# Altium schematic sheet BQ105-A4.SchDoc
size A2
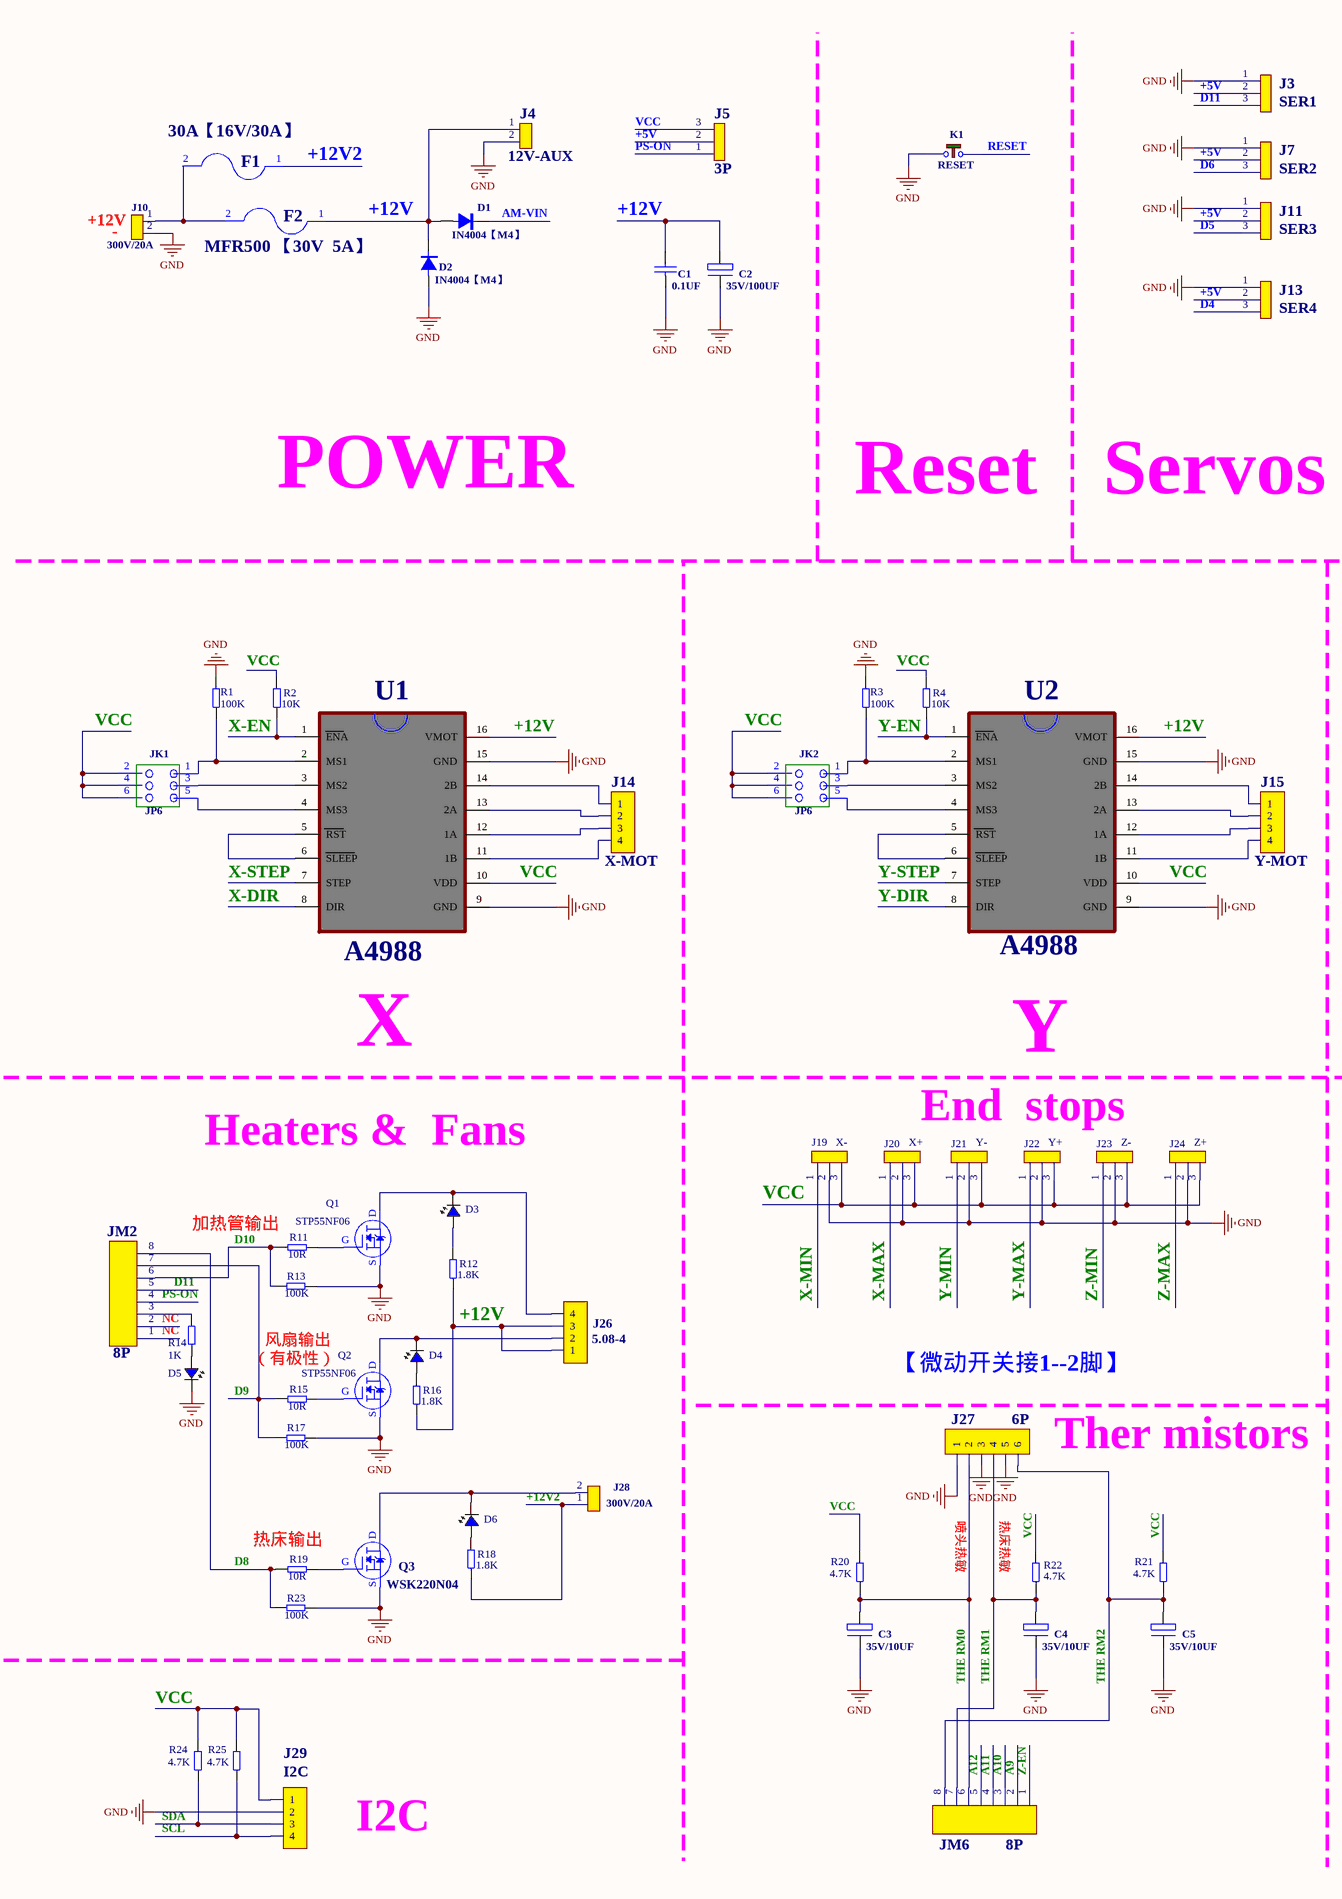
[diagram p0: BQ105-A4.SchDoc, left]
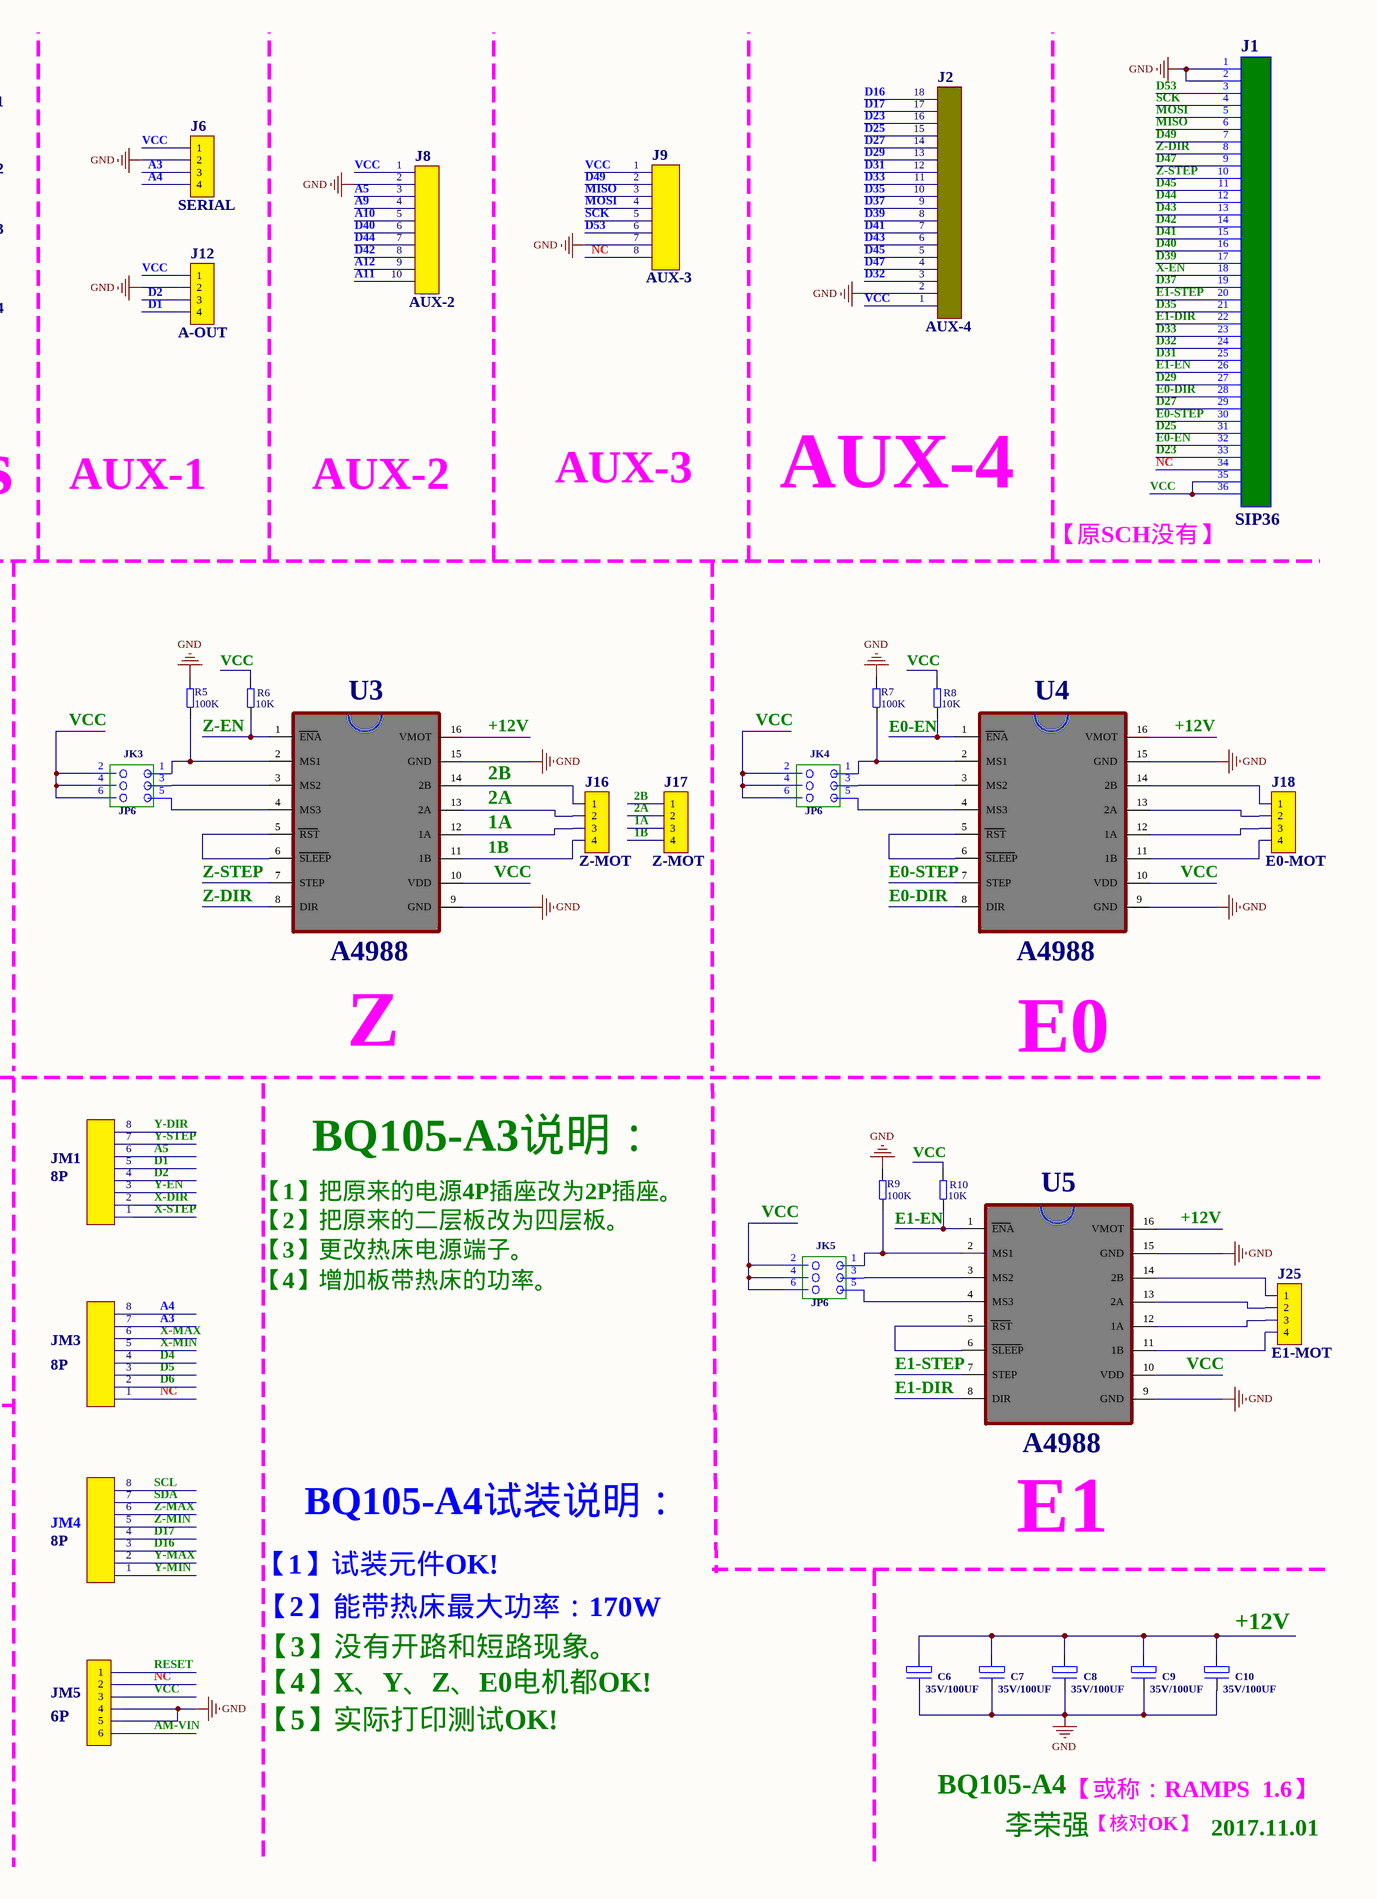
[diagram p1: BQ105-A4.SchDoc, right]

## Parts
C1  0.1UF  [0603N]
C2  35V/100UF  [35V/100UF-2]
C3  35V/10UF  [35V/10UF]
C4  35V/10UF  [35V/10UF]
C5  35V/10UF  [35V/10UF]
C6  35V/100UF  [35V/100UF-2]
C7  35V/100UF  [35V/100UF-2]
C8  35V/100UF  [35V/100UF-2]
C9  35V/100UF  [35V/100UF-2]
C10  35V/100UF  [35V/100UF-2]
D1  IN4004【M4】  [DO-214AC]
D2  IN4004【M4】  [DO-214AC]
D3  LED  [LED-0603]  (value not drawn)
D4  LED  [LED-0603]  (value not drawn)
D5  LED  [LED-0603]  (value not drawn)
D6  LED  [LED-0603]  (value not drawn)
F1  30A【16V/30A】  [1206]
F2  MFR500 【30V  5A】  [1206]
J1  SIP36  [2.54-36]
J2  AUX-4  [SIP18]
J3  SER1  [SIP3]
J4  12V-AUX  [SIP2]
J5  3P  [SIP3]
J6  SERIAL  [2.54-4]
J7  SER2  [SIP3]
J8  AUX-2  [2.54-10]
J9  AUX-3  [2.54-8]
J10  300V/20A  [5.08-2]
J11  SER3  [SIP3]
J12  A-OUT  [2.54-4]
J13  SER4  [SIP3]
J14  X-MOT  [SIP4]
J15  Y-MOT  [SIP4]
J16  Z-MOT  [SIP4]
J17  Z-MOT  [SIP4]
J18  E0-MOT  [SIP4]
J19  X-  [SIP3]
J20  X+  [SIP3]
J21  Y-  [SIP3]
J22  Y+  [SIP3]
J23  Z-  [SIP3]
J24  Z+  [SIP3]
J25  E1-MOT  [SIP4]
J26  5.08-4  [5.08-4-B]
J27  6P  [2.54-6]
J28  300V/20A  [5.08-2]
J29  I2C  [SIP4]
JK1  JP6  [ICSP-6]
JK2  JP6  [ICSP-6]
JK3  JP6  [ICSP-6]
JK4  JP6  [ICSP-6]
JK5  JP6  [ICSP-6]
JM1  8P  [SIP8]
JM2  8P  [SIP8]
JM3  8P  [SIP8]
JM4  8P  [SIP8]
JM5  6P  [SIP6]
JM6  8P  [SIP8]
K1  RESET  [K7]
Q1  STP55NF06  [TO-263-M]
Q2  STP55NF06  [TO-263-M]
Q3  WSK220N04  [TO-263-M]
R1  100K  [0603N]
R2  10K  [0603N]
R3  100K  [0603N]
R4  10K  [0603N]
R5  100K  [0603N]
R6  10K  [0603N]
R7  100K  [0603N]
R8  10K  [0603N]
R9  100K  [0603N]
R10  10K  [0603N]
R11  10R  [0603N]
R12  1.8K  [0603N]
R13  100K  [0603N]
R14  1K  [0603N]
R15  10R  [0603N]
R16  1.8K  [0603N]
R17  100K  [0603N]
R18  1.8K  [0603N]
R19  10R  [0603N]
R20  4.7K  [0603N]
R21  4.7K  [0603N]
R22  4.7K  [0603N]
R23  100K  [0603N]
R24  4.7K  [0603N]
R25  4.7K  [0603N]
U1  A4988  [A4988-2]
U2  A4988  [A4988-2]
U3  A4988  [A4988-2]
U4  A4988  [A4988-2]
U5  A4988  [A4988-2]

## Nets
GND: C1.1 C2.2(-) C3.2(-) C4.2(-) C5.2(-) C6.2(-) C7.2(-) C8.2(-) C9.2(-) C10.2(-) D2.1(A) D5.2(K) J1.1 J1.2 J2.2 J3.1 J4.2 J6.2 J7.1 J8.2 J9.7 J10.2 J11.1 J12.2 J13.1 J19.2 J20.2 J21.2 J22.2 J23.2 J24.2 J27.1 J27.3 J27.5 J29.2 JM5.4 JM5.5 K1.1 Q1.S Q2.S Q3.S R1.2 R3.2 R5.2 R7.2 R9.2 R13.2 R17.2 R23.2 U1.9(GND) U1.15(GND) U2.9(GND) U2.15(GND) U3.9(GND) U3.15(GND) U4.9(GND) U4.15(GND) U5.9(GND) U5.15(GND)
1A: J16.3 J17.3 U3.12(1A)
1B: J16.4 J17.4 U3.11(1B)
2A: J16.2 J17.2 U3.13(2A)
2B: J16.1 J17.1 U3.14(2B)
+5V: J3.2 J5.2 J7.2 J11.2 J13.2
+12V: C1.2 C2.1(+) C6.1(+) C7.1(+) C8.1(+) C9.1(+) C10.1(+) D1.1(A) D2.2(K) F2.1 J4.1 J26.1 J26.3 R12.1 R16.1 U1.16(VMOT) U2.16(VMOT) U3.16(VMOT) U4.16(VMOT) U5.16(VMOT)
+12V2: F1.1 J28.1 R18.1
A3: J6.3 JM3.7
A4: J6.4 JM3.8
A5: J8.3 JM1.6
A9: J8.4 JM6.2
A10: J8.5 JM6.3
A11: J8.10 JM6.4
A12: J8.9 JM6.5
AM-VIN: D1.2(K) JM5.6
D1: J12.4 JM1.5
D2: J12.3 JM1.4
D4: J13.3 JM3.4
D5: J11.3 JM3.3
D6: J7.3 JM3.2
D8: JM2.8 R19.1 R23.1
D9: JM2.7 R15.1 R17.1
D10: JM2.6 R11.1 R13.1
D11: J3.3 JM2.5
D16: J2.18 JM4.3
D17: J2.17 JM4.4
D23: J1.33 J2.16
D25: J1.31 J2.15
D27: J1.29 J2.14
D29: J1.27 J2.13
D31: J1.25 J2.12
D32: J1.24 J2.3
D33: J1.23 J2.11
D35: J1.21 J2.10
D37: J1.19 J2.9
D39: J1.17 J2.8
D40: J1.16 J8.6
D41: J1.15 J2.7
D42: J1.14 J8.8
D43: J1.13 J2.6
D44: J1.12 J8.7
D45: J1.11 J2.5
D47: J1.9 J2.4
D49: J1.7 J9.2
D53: J1.3 J9.6
E0-DIR: J1.28 U4.8(DIR)
E0-EN: J1.32 R8.1 U4.1(ENA)
E0-STEP: J1.30 U4.7(STEP)
E1-DIR: J1.22 U5.8(DIR)
E1-EN: J1.26 R10.1 U5.1(ENA)
E1-STEP: J1.20 U5.7(STEP)
MISO: J1.6 J9.3
MOSI: J1.5 J9.4
PS-ON: J5.1 JM2.4
RESET: JM5.1 K1.2
SCK: J1.4 J9.5
SCL: J29.4 JM4.8 R25.1
SDA: J29.3 JM4.7 R24.1
THE RM0: C3.1(+) J27.2 JM6.6 R20.1
THE RM1: C4.1(+) J27.4 JM6.7 R22.1
THE RM2: C5.1(+) J27.6 JM6.8 R21.1
VCC: J1.35 J1.36 J2.1 J5.3 J6.1 J8.1 J9.1 J12.1 J19.3 J20.3 J21.3 J22.3 J23.3 J24.3 J29.1 JK1.2 JK1.4 JK1.6 JK2.2 JK2.4 JK2.6 JK3.2 JK3.4 JK3.6 JK4.2 JK4.4 JK4.6 JK5.2 JK5.4 JK5.6 JM5.3 R2.2 R4.2 R6.2 R8.2 R10.2 R20.2 R21.2 R22.2 R24.2 R25.2 U1.10(VDD) U2.10(VDD) U3.10(VDD) U4.10(VDD) U5.10(VDD)
X-DIR: JM1.2 U1.8(DIR)
X-EN: J1.18 R2.1 U1.1(ENA)
X-MAX: J20.1 JM3.6
X-MIN: J19.1 JM3.5
X-STEP: JM1.1 U1.7(STEP)
Y-DIR: JM1.8 U2.8(DIR)
Y-EN: JM1.3 R4.1 U2.1(ENA)
Y-MAX: J22.1 JM4.2
Y-MIN: J21.1 JM4.1
Y-STEP: JM1.7 U2.7(STEP)
Z-DIR: J1.8 U3.8(DIR)
Z-EN: JM6.1 R6.1 U3.1(ENA)
Z-MAX: J24.1 JM4.6
Z-MIN: J23.1 JM4.5
Z-STEP: J1.10 U3.7(STEP)
NetD3_1: D3.1(A) R12.2
NetD3_2: D3.2(K) J26.4 Q1.D
NetD4_1: D4.1(A) R16.2
NetD4_2: D4.2(K) J26.2 Q2.D
NetD5_1: D5.1(A) R14.2
NetD6_1: D6.1(A) R18.2
NetD6_2: D6.2(K) J28.2 Q3.D
NetF1_2: F1.2 F2.2 J10.1
NetJ14_1: J14.1 U1.14(2B)
NetJ14_2: J14.2 U1.13(2A)
NetJ14_3: J14.3 U1.12(1A)
NetJ14_4: J14.4 U1.11(1B)
NetJ15_1: J15.1 U2.14(2B)
NetJ15_2: J15.2 U2.13(2A)
NetJ15_3: J15.3 U2.12(1A)
NetJ15_4: J15.4 U2.11(1B)
NetJ18_1: J18.1 U4.14(2B)
NetJ18_2: J18.2 U4.13(2A)
NetJ18_3: J18.3 U4.12(1A)
NetJ18_4: J18.4 U4.11(1B)
NetJ25_1: J25.1 U5.14(2B)
NetJ25_2: J25.2 U5.13(2A)
NetJ25_3: J25.3 U5.12(1A)
NetJ25_4: J25.4 U5.11(1B)
NetJK1_1: JK1.1 R1.1 U1.2(MS1)
NetJK1_3: JK1.3 U1.3(MS2)
NetJK1_5: JK1.5 U1.4(MS3)
NetJK2_1: JK2.1 R3.1 U2.2(MS1)
NetJK2_3: JK2.3 U2.3(MS2)
NetJK2_5: JK2.5 U2.4(MS3)
NetJK3_1: JK3.1 R5.1 U3.2(MS1)
NetJK3_3: JK3.3 U3.3(MS2)
NetJK3_5: JK3.5 U3.4(MS3)
NetJK4_1: JK4.1 R7.1 U4.2(MS1)
NetJK4_3: JK4.3 U4.3(MS2)
NetJK4_5: JK4.5 U4.4(MS3)
NetJK5_1: JK5.1 R9.1 U5.2(MS1)
NetJK5_3: JK5.3 U5.3(MS2)
NetJK5_5: JK5.5 U5.4(MS3)
NetJM2_3: JM2.3 R14.1
NetQ1_G: Q1.G R11.2
NetQ2_G: Q2.G R15.2
NetQ3_G: Q3.G R19.2
NetU1_5: U1.5(RST) U1.6(SLEEP)
NetU2_5: U2.5(RST) U2.6(SLEEP)
NetU3_5: U3.5(RST) U3.6(SLEEP)
NetU4_5: U4.5(RST) U4.6(SLEEP)
NetU5_5: U5.5(RST) U5.6(SLEEP)

Not connected (* = marked no-connect by the designer): J1 34; J9 8; JM2 1 2; JM3 1; JM5 2

## Notes on the sheet
- (near J10) +12V
- (near J10) -
- NC
- POWER
- Reset
- Servos
- AUX-1
- AUX-2
- AUX-3
- AUX-4
- 【原SCH没有】
- X
- Y
- Z
- E0
- End  stops
- Heaters &  Fans
- BQ105-A3说明：
- 加热管输出
- 【1】把原来的电源4P插座改为2P插座。
- 【2】把原来的二层板改为四层板。
- 【3】更改热床电源端子。
- 【4】增加板带热床的功率。
- (near R15) （有极性）
- 风扇输出
- 【微动开关接1--2脚】
- (near JM3) NC
- (near J27) Ther mistors
- (near R19) 热床输出
- 喷头热敏
- (near R22) 热床热敏
- BQ105-A4试装说明：
- E1
- 【1】试装元件OK!
- 【2】能带热床最大功率：170W
- (near JM5) NC
- 【3】没有开路和短路现象。
- 【4】X、Y、Z、E0电机都OK!
- 【5】实际打印测试OK!
- BQ105-A4
- 【或称：RAMPS  1.6】
- I2C
- 李荣强
- 【核对OK】
- 2017.11.01

## Library data of the parts
C1 = CAP
C2-C10 = C
D1 D2 = DIODE
F1 F2 = FUSE
J2 = SIP18
J3 J5 J7 J11 J13 J19-J24 = SIP3
J4 J10 J28 = SIP2
J6 J12 J14-J18 J25 J26 J29 = SIP4
J8 = SIP10
J9 JM1-JM4 JM6 = SIP8
J27 JM5 = SIP6
K1 = K3
Q1-Q3 = NMOS
R1-R25 = RES